# Altium project 1_Footprint.PrjPCB
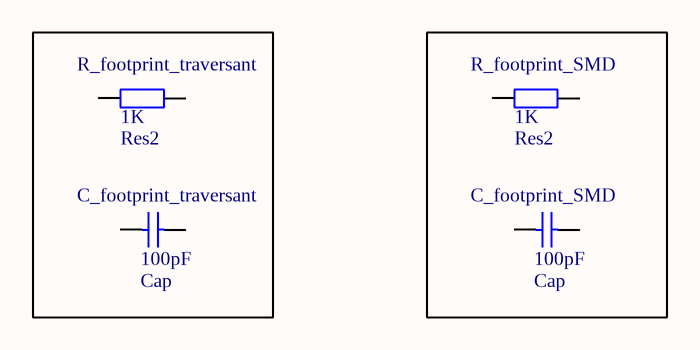
[diagram p0: 1_Footprint.SchDoc]
1 sheet, 4 parts. Net scope: global (net labels, ports and power ports of the same name join across sheets).
Board file: 1_Footprint.PcbDoc

## Sheet 1_Footprint.SchDoc
size A4

### Parts
C_footprint_SMD  Cap  value 100pF  [Capacitor 1206]
C_footprint_traversant  Cap  value 100pF  [RAD-0.3]
R_footprint_SMD  Res2  value 1K  [Resistor 1206]
R_footprint_traversant  Res2  value 1K  [AXIAL-0.4]

### Nets

Not connected (* = marked no-connect by the designer): C_footprint_SMD 1 2; C_footprint_traversant 1 2; R_footprint_SMD 1 2; R_footprint_traversant 1 2

### Library data of the parts
C_footprint_SMD C_footprint_traversant = Cap: Capacitor; Published: 8-Jun-2000; LatestRevisionDate: 17-Jul-2002; LatestRevisionNote: Re-released for DXP Platform.; PackageReference: RAD-0.3; Publisher: Altium Limited; PackageDescription: Radial Cap, Thru-Hole; 2 Leads; 0.3 in Pin Spacing
R_footprint_SMD R_footprint_traversant = Res2: Resistor; Published: 8-Jun-2000; LatestRevisionDate: 17-Jul-2002; LatestRevisionNote: Re-released for DXP Platform.; PackageReference: AXIAL-0.4; Publisher: Altium Limited; PackageDescription: Axial Device, Thru-Hole; 2 Leads; 0.4 in Pin Spacing